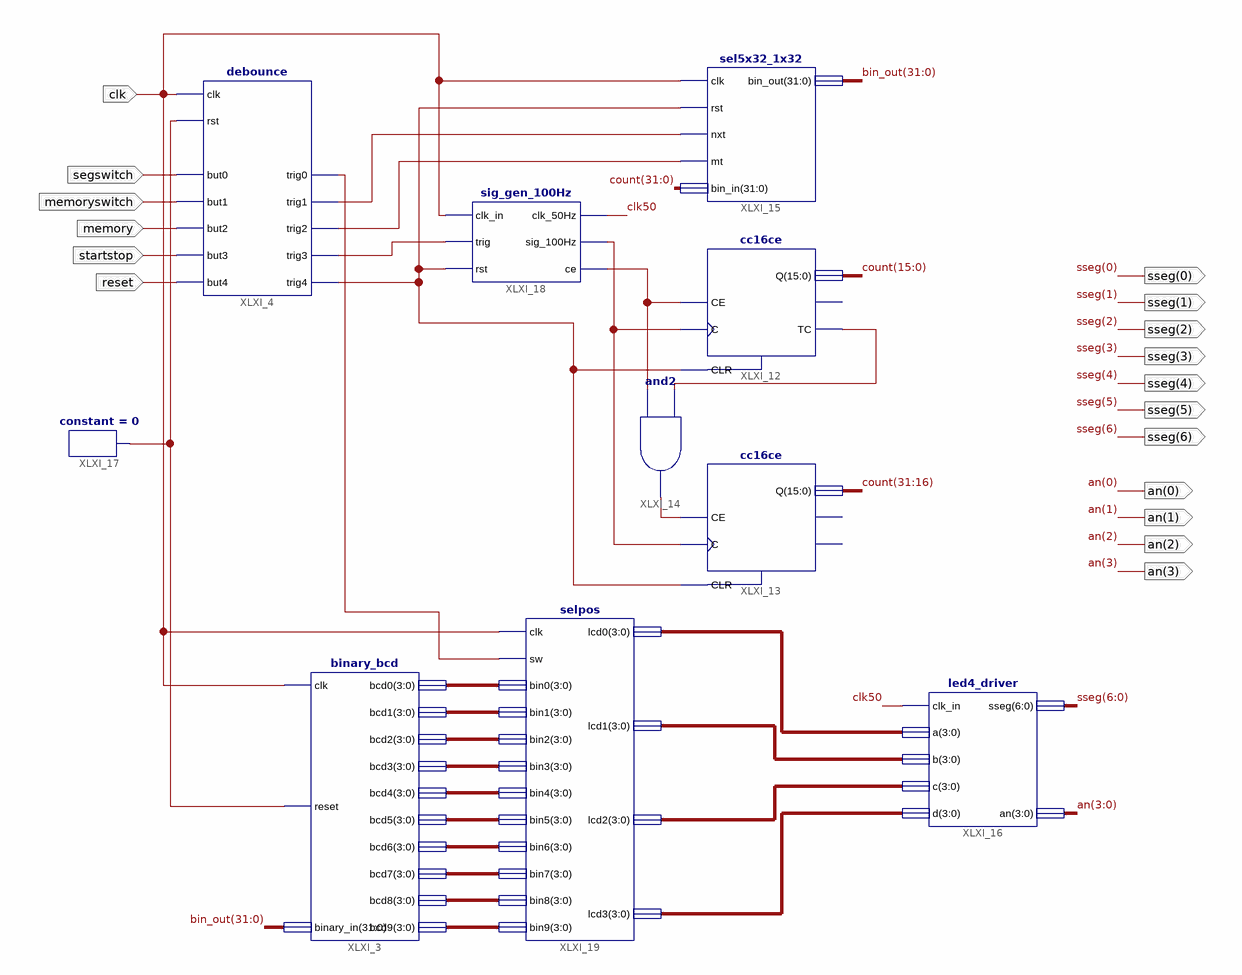
[diagram p0: schematic sheet 1]
// Xilinx ISE schematic pomiarT.sch (spartan3e) as structural Verilog: 10 symbols, 18 ports
module pomiarT (
  input  reset,
  input  startstop,
  input  memory,
  input  memoryswitch,
  input  segswitch,
  input  XLXN_58,
  input  clk,
  output [6:0] sseg,
  output [3:0] an
);

  wire clk50, XLXN_3, XLXN_4, XLXN_5, XLXN_6, XLXN_27, XLXN_31, XLXN_32, XLXN_34, XLXN_41, XLXN_42;
  wire [3:0] XLXN_43, XLXN_44, XLXN_45, XLXN_46, XLXN_47, XLXN_48, XLXN_49, XLXN_50, XLXN_51, XLXN_52,
       XLXN_53, XLXN_54, XLXN_55, XLXN_56;
  wire [31:0] bin_out, count;

  binary_bcd XLXI_3 (
    .clk(clk), .reset(XLXN_34), .binary_in(bin_out), .bcd0(XLXN_43), .bcd1(XLXN_44), .bcd2(XLXN_45),
    .bcd3(XLXN_46), .bcd4(XLXN_47), .bcd5(XLXN_48), .bcd6(XLXN_49), .bcd7(XLXN_50), .bcd8(XLXN_51),
    .bcd9(XLXN_52));
  debounce XLXI_4 (
    .clk(clk), .rst(XLXN_34), .but0(segswitch), .but1(memoryswitch), .but2(memory), .but3(startstop),
    .but4(reset), .trig0(XLXN_42), .trig1(XLXN_32), .trig2(XLXN_31), .trig3(XLXN_41), .trig4(XLXN_27));
  cc16ce XLXI_12 (.C(XLXN_6), .CE(XLXN_5), .CLR(XLXN_27), .Q(count[15:0]), .TC(XLXN_4));  // open: CEO
  cc16ce XLXI_13 (.C(XLXN_6), .CE(XLXN_3), .CLR(XLXN_27), .Q(count[31:16]));  // open: CEO, TC
  and XLXI_14 (XLXN_3, XLXN_5, XLXN_4);
  sel5x32_1x32 XLXI_15 (.clk(clk), .rst(XLXN_27), .nxt(XLXN_32), .mt(XLXN_31), .bin_in(count), .bin_out(bin_out));
  led4_driver XLXI_16 (.clk_in(clk50), .a(XLXN_56), .b(XLXN_55), .c(XLXN_54), .d(XLXN_53), .sseg(sseg), .an(an));
  constant #(.CValue("0")) XLXI_17 (.O(XLXN_34));
  sig_gen_100Hz XLXI_18 (
    .clk_in(clk), .trig(XLXN_41), .rst(XLXN_27), .clk_50Hz(clk50), .sig_100Hz(XLXN_6), .ce(XLXN_5));
  selpos XLXI_19 (
    .clk(clk), .sw(XLXN_42), .bin0(XLXN_43), .bin1(XLXN_44), .bin2(XLXN_45), .bin3(XLXN_46), .bin4(XLXN_47),
    .bin5(XLXN_48), .bin6(XLXN_49), .bin7(XLXN_50), .bin8(XLXN_51), .bin9(XLXN_52), .lcd0(XLXN_56),
    .lcd1(XLXN_55), .lcd2(XLXN_54), .lcd3(XLXN_53));

  // Notes on the sheet:
  //   LOC on signal reset = D18
  //   LOC on signal startstop = B18
  //   LOC on signal memory = E18
  //   LOC on signal memoryswitch = H13
  //   LOC on signal segswitch = G18
  //   LOC on signal clk = B8
  //   LOC on signal sseg(0) = L18
  //   LOC on signal sseg(1) = F18
  //   LOC on signal sseg(2) = D17
  //   LOC on signal sseg(3) = D16
  //   LOC on signal sseg(4) = G14
  //   LOC on signal sseg(5) = J17
  //   LOC on signal sseg(6) = H14
  //   LOC on signal an(0) = F17
  //   LOC on signal an(1) = H17
  //   LOC on signal an(2) = C18
  //   LOC on signal an(3) = F15
endmodule
